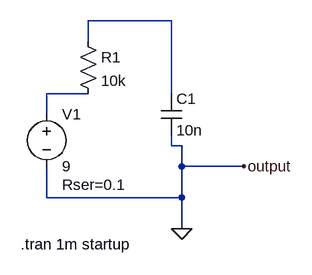
[diagram p0: schematic Draft2.asc]
Draft2.asc, the LTspice schematic file:
Version 4.1
SHEET 1 880 680
WIRE 288 -16 160 -16
WIRE 160 16 160 -16
WIRE 160 96 96 96
WIRE 288 96 288 -16
WIRE 96 128 96 96
WIRE 288 176 288 160
WIRE 304 176 288 176
WIRE 304 208 304 176
WIRE 400 208 304 208
WIRE 96 256 96 208
WIRE 304 256 304 208
WIRE 304 256 96 256
WIRE 304 304 304 256
FLAG 304 304 0
FLAG 400 208 output
SYMBOL voltage 96 112 R0
WINDOW 123 0 0 Left 0
WINDOW 39 24 124 Left 2
SYMATTR InstName V1
SYMATTR Value 9
SYMATTR SpiceLine Rser=0.1
SYMBOL res 144 0 R0
SYMATTR InstName R1
SYMATTR Value 10k
SYMBOL cap 272 96 R0
SYMATTR InstName C1
SYMATTR Value 10n
TEXT 56 328 Left 2 !.tran 1m startup

The netlist it stands for:
* Draft2.asc
V1 N002 0 9 Rser=0.1
R1 N001 N002 10k
C1 N001 0 10n
.tran 1m startup
.backanno
.end